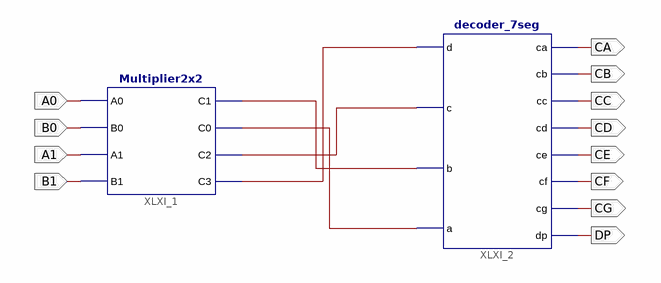
[diagram p0: schematic sheet 1]
// Xilinx ISE schematic Multi.sch (spartan3e) as structural Verilog: 2 symbols, 12 ports
module Multi (
  input  A0,
  input  B0,
  input  A1,
  input  B1,
  output DP,
  output CG,
  output CF,
  output CE,
  output CD,
  output CC,
  output CB,
  output CA
);

  wire XLXN_1, XLXN_2, XLXN_3, XLXN_4;

  Multiplier2x2 XLXI_1 (.A0(A0), .A1(A1), .B0(B0), .B1(B1), .C0(XLXN_1), .C1(XLXN_4), .C2(XLXN_2), .C3(XLXN_3));
  decoder_7seg XLXI_2 (
    .d(XLXN_3), .c(XLXN_2), .b(XLXN_4), .a(XLXN_1), .ca(CA), .cb(CB), .cc(CC), .cd(CD), .ce(CE), .cf(CF),
    .cg(CG), .dp(DP));
endmodule
